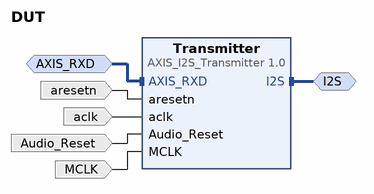
[diagram p0: block diagram of the top level]
# Vivado block design DUT, xc7z010clg400-1, Vivado 2019.2.1
create_bd_design DUT

create_bd_intf_port -mode Master -vlnv www.kampis-elektroecke.de:Kampis-Elektroecke:I2S_rtl:1.0 I2S
create_bd_intf_port -mode Slave -vlnv xilinx.com:interface:axis_rtl:1.0 AXIS_RXD
set_property -dict [list \
  CONFIG.TDATA_NUM_BYTES 4 \
  CONFIG.TDEST_WIDTH 0 \
  CONFIG.TID_WIDTH 0 \
  CONFIG.TUSER_WIDTH 0 \
  CONFIG.HAS_TREADY 1 \
  CONFIG.HAS_TSTRB 0 \
  CONFIG.HAS_TKEEP 0 \
  CONFIG.HAS_TLAST 0 \
  CONFIG.FREQ_HZ 125000000 \
  CONFIG.LAYERED_METADATA undef \
] [get_bd_intf_ports AXIS_RXD]
create_bd_port -dir I -type rst aresetn
create_bd_port -dir I -type clk aclk
set_property -dict {CONFIG.ASSOCIATED_BUSIF AXIS_RXD CONFIG.ASSOCIATED_RESET aresetn CONFIG.FREQ_HZ 125000000} [get_bd_ports aclk]
create_bd_port -dir I -type rst Audio_Reset
create_bd_port -dir I -type clk MCLK
set_property -dict {CONFIG.ASSOCIATED_RESET Audio_Reset_0 CONFIG.FREQ_HZ 12500000} [get_bd_ports MCLK]

create_bd_cell -type ip -vlnv www.Kampis-Elektroecke.com:Kampis-Elektroecke:AXIS_I2S_Transmitter:1.0 Transmitter

# ---- connections ----

connect_bd_intf_net -intf_net AXIS_RXD_0_1 [get_bd_intf_ports AXIS_RXD] [get_bd_intf_pins Transmitter/AXIS_RXD]
connect_bd_intf_net [get_bd_intf_ports I2S] [get_bd_intf_pins Transmitter/I2S]
connect_bd_net -net aresetn_0_1 [get_bd_ports aresetn] [get_bd_pins Transmitter/aresetn]
connect_bd_net -net aclk_0_1 [get_bd_ports aclk] [get_bd_pins Transmitter/aclk]
connect_bd_net -net Audio_Reset_0_1 [get_bd_ports Audio_Reset] [get_bd_pins Transmitter/Audio_Reset]
connect_bd_net -net MCLK_0_1 [get_bd_ports MCLK] [get_bd_pins Transmitter/MCLK]

validate_bd_design
save_bd_design
